# EAGLE design rgbw2 (EAGLE 6.6.0)
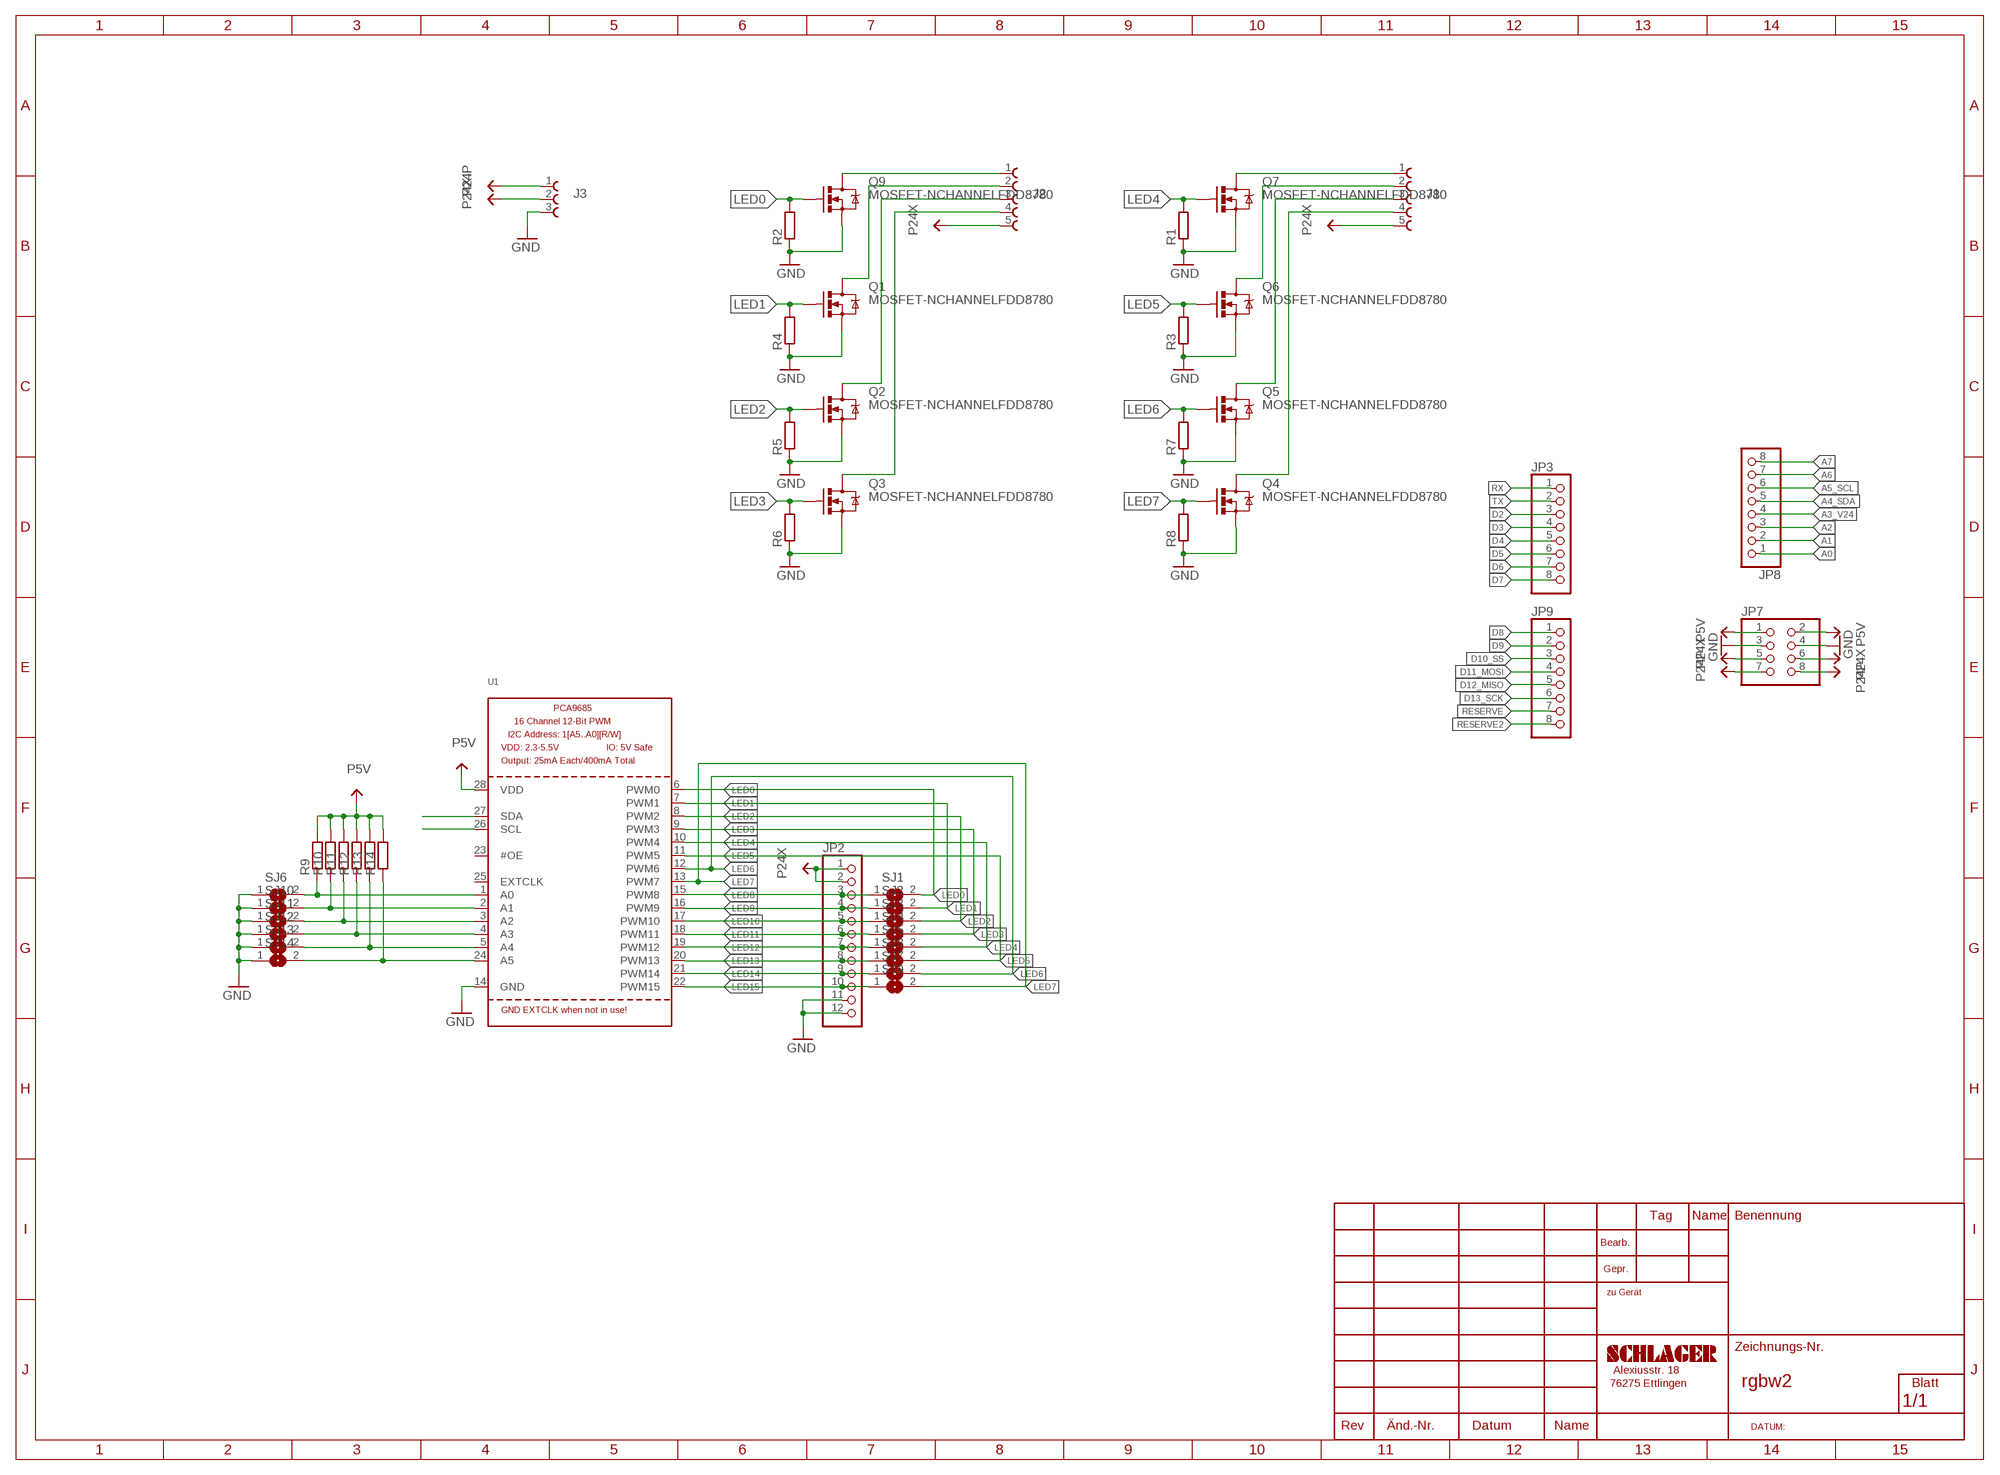
[diagram p0: schematic, sheet 1]

## Parts
J1  691322310005  [691322310005]
J2  691322310005  [691322310005]
J3  691313510003  [691313510003]
JP2  PINHD-1X12  [1X12]
JP3  PINHD-1X8  [1X08]
JP7  PINHD-2X4  [2X04]
JP8  PINHD-1X8  [1X08]
JP9  PINHD-1X8  [1X08]
Q1  MOSFET-NCHANNELFDD8780  [DPAK]
Q2  MOSFET-NCHANNELFDD8780  [DPAK]
Q3  MOSFET-NCHANNELFDD8780  [DPAK]
Q4  MOSFET-NCHANNELFDD8780  [DPAK]
Q5  MOSFET-NCHANNELFDD8780  [DPAK]
Q6  MOSFET-NCHANNELFDD8780  [DPAK]
Q7  MOSFET-NCHANNELFDD8780  [DPAK]
Q9  MOSFET-NCHANNELFDD8780  [DPAK]
R1  R-EU_R0805  [R0805]
R2  R-EU_R0805  [R0805]
R3  R-EU_R0805  [R0805]
R4  R-EU_R0805  [R0805]
R5  R-EU_R0805  [R0805]
R6  R-EU_R0805  [R0805]
R7  R-EU_R0805  [R0805]
R8  R-EU_R0805  [R0805]
R9  R-EU_R0805  [R0805]
R10  R-EU_R0805  [R0805]
R11  R-EU_R0805  [R0805]
R12  R-EU_R0805  [R0805]
R13  R-EU_R0805  [R0805]
R14  R-EU_R0805  [R0805]
SJ1  SJN  [SJ]
SJ2  SJN  [SJ]
SJ3  SJN  [SJ]
SJ4  SJN  [SJ]
SJ5  SJN  [SJ]
SJ6  SJN  [SJ]
SJ7  SJN  [SJ]
SJ8  SJN  [SJ]
SJ9  SJN  [SJ]
SJ10  SJN  [SJ]
SJ11  SJN  [SJ]
SJ12  SJN  [SJ]
SJ13  SJN  [SJ]
SJ14  SJN  [SJ]
U1  PCA9685  [TSSOP28]

## Nets
A0: JP8.1
A1: JP8.2
A2: JP8.3
A3_V24: JP8.4
A4_SDA: JP8.5 U1.27(SDA)
A5_SCL: JP8.6 U1.26(SCL)
A6: JP8.7
A7: JP8.8
D2: JP3.3
D3: JP3.4
D4: JP3.5
D5: JP3.6
D6: JP3.7
D7: JP3.8
D8: JP9.1
D9: JP9.2
D10_SS: JP9.3
D11_MOSI: JP9.4
D12_MISO: JP9.5
D13_SCK: JP9.6
GND: J3.3 JP2.11 JP2.12 JP7.3 JP7.4 Q1.3(S) Q2.3(S) Q3.3(S) Q4.3(S) Q5.3(S) Q6.3(S) Q7.3(S) Q9.3(S) R1.1 R2.1 R3.1 R4.1 R5.1 R6.1 R7.1 R8.1 SJ6.1 SJ10.1 SJ11.1 SJ12.1 SJ13.1 SJ14.1 U1.14(GND)
LED0: Q9.1(G) R2.2 SJ1.2 U1.6(PWM0)
LED1: Q1.1(G) R4.2 SJ2.2 U1.7(PWM1)
LED2: Q2.1(G) R5.2 SJ3.2 U1.8(PWM2)
LED3: Q3.1(G) R6.2 SJ4.2 U1.9(PWM3)
LED4: Q7.1(G) R1.2 SJ5.2 U1.10(PWM4)
LED5: Q6.1(G) R3.2 SJ8.2 U1.11(PWM5)
LED6: Q5.1(G) R7.2 SJ7.2 U1.12(PWM6)
LED7: Q4.1(G) R8.2 SJ9.2 U1.13(PWM7)
LED8: JP2.3 SJ1.1 U1.15(PWM8)
LED9: JP2.4 SJ2.1 U1.16(PWM9)
LED10: JP2.5 SJ3.1 U1.17(PWM10)
LED11: JP2.6 SJ4.1 U1.18(PWM11)
LED12: JP2.7 SJ5.1 U1.19(PWM12)
LED13: JP2.8 SJ8.1 U1.20(PWM13)
LED14: JP2.9 SJ7.1 U1.21(PWM14)
LED15: JP2.10 SJ9.1 U1.22(PWM15)
N$1: R9.1 SJ6.2 U1.1(A0)
N$2: J2.1 Q9.4(D)
N$3: J2.2 Q1.4(D)
N$4: J1.3 Q5.4(D)
N$5: J2.3 Q2.4(D)
N$6: J2.4 Q3.4(D)
N$7: J1.4 Q4.4(D)
N$8: J1.1 Q7.4(D)
N$9: J1.2 Q6.4(D)
N$10: R10.1 SJ10.2 U1.2(A1)
N$11: R11.1 SJ11.2 U1.3(A2)
N$12: R12.1 SJ12.2 U1.4(A3)
N$13: R13.1 SJ13.2 U1.5(A4)
N$14: R14.1 SJ14.2 U1.24(A5)
P5V: JP7.1 JP7.2 R9.2 R10.2 R11.2 R12.2 R13.2 R14.2 U1.28(VDD)
P24P: J3.1 JP7.7 JP7.8
P24X: J1.5 J2.5 J3.2 JP2.1 JP2.2 JP7.5 JP7.6
RESERVE: JP9.7
RESERVE2: JP9.8
RX: JP3.1
TX: JP3.2
Unconnected: U1.23(#OE) U1.25(EXTCLK)

## Library data of the parts
J1 J2 = Eagle_TERMINAL_BLOCKS_rev16a:691322310005: WR-TBL Serie 322 - 3.81mm Vertical PCB Header , 5 Pins=>Code : Con_TBL_Pluggable_3.81_PCB_THT_Simple_691322310005 <http://katalog.we-online.de/media/images/eican/Con_TBL_Pluggable_3.81_PCB_THT_Simple_6913223100xx_pf2.jpg> Details see: http://katalog.we-online.de/en/em/691_322_310_0xx Created 2014-06-19, Karrer Zheng 2014 (C) Würth Elektronik
J3 = Eagle_TERMINAL_BLOCKS_rev16a:691313510003: WR-TBL Serie 313 - 5.08 mm Close Horizontal PCB Header , 3 Pins=>Code : Con_TBL_Pluggable_5.08_PCB_THT_Simple_H_691313510003 <http://katalog.we-online.de/media/images/eican/Con_TBL_Pluggable_5.08_PCB_THT_Simple_H_6913135100xx_pf2.jpg> Details see: http://katalog.we-online.de/en/em/691_313_510_0xx Created 2014-06-25, Karrer Zheng 2014 (C) Würth Elektronik
JP2 = pinhead:PINHD-1X12: PIN HEADER
JP3 JP8 JP9 = pinhead:PINHD-1X8: PIN HEADER
JP7 = pinhead:PINHD-2X4: PIN HEADER
Q1-Q7 Q9 = SparkFun-DiscreteSemi:MOSFET-NCHANNEL: Common NMOSFET Parts MFG P/N Store ID Prod ID FDD8780 TRANS-09984 SI7820DN TRANS-11055 FDS6630A IC-08089 2N7002PW TRANS-11151 FQP30N06L COM-10213 TRANS-10060 BSS123LT1G TRANS-08345 BSS138 TRANS-00830 BS170 2N7000; PROD_ID: TRANS-09984
R1-R14 = schlager_passiv:R-EU_: RESISTOR, European symbol
SJ1-SJ14 = jumper:SJ: SMD solder JUMPER
U1 = adafruit:PCA9685: PCA9685 - 16 Channel 12-Bit I2C PWM Controller 5.0V tolerant 16 channel, 12-bit I2C PWM controller with 25mA per output (max. 400mA total) Digikey: 568-5931-1-ND

## Net classes
4 USBpair: width 0.254 mm, drill 0.406 mm, clearance 0.508 mm

## Board
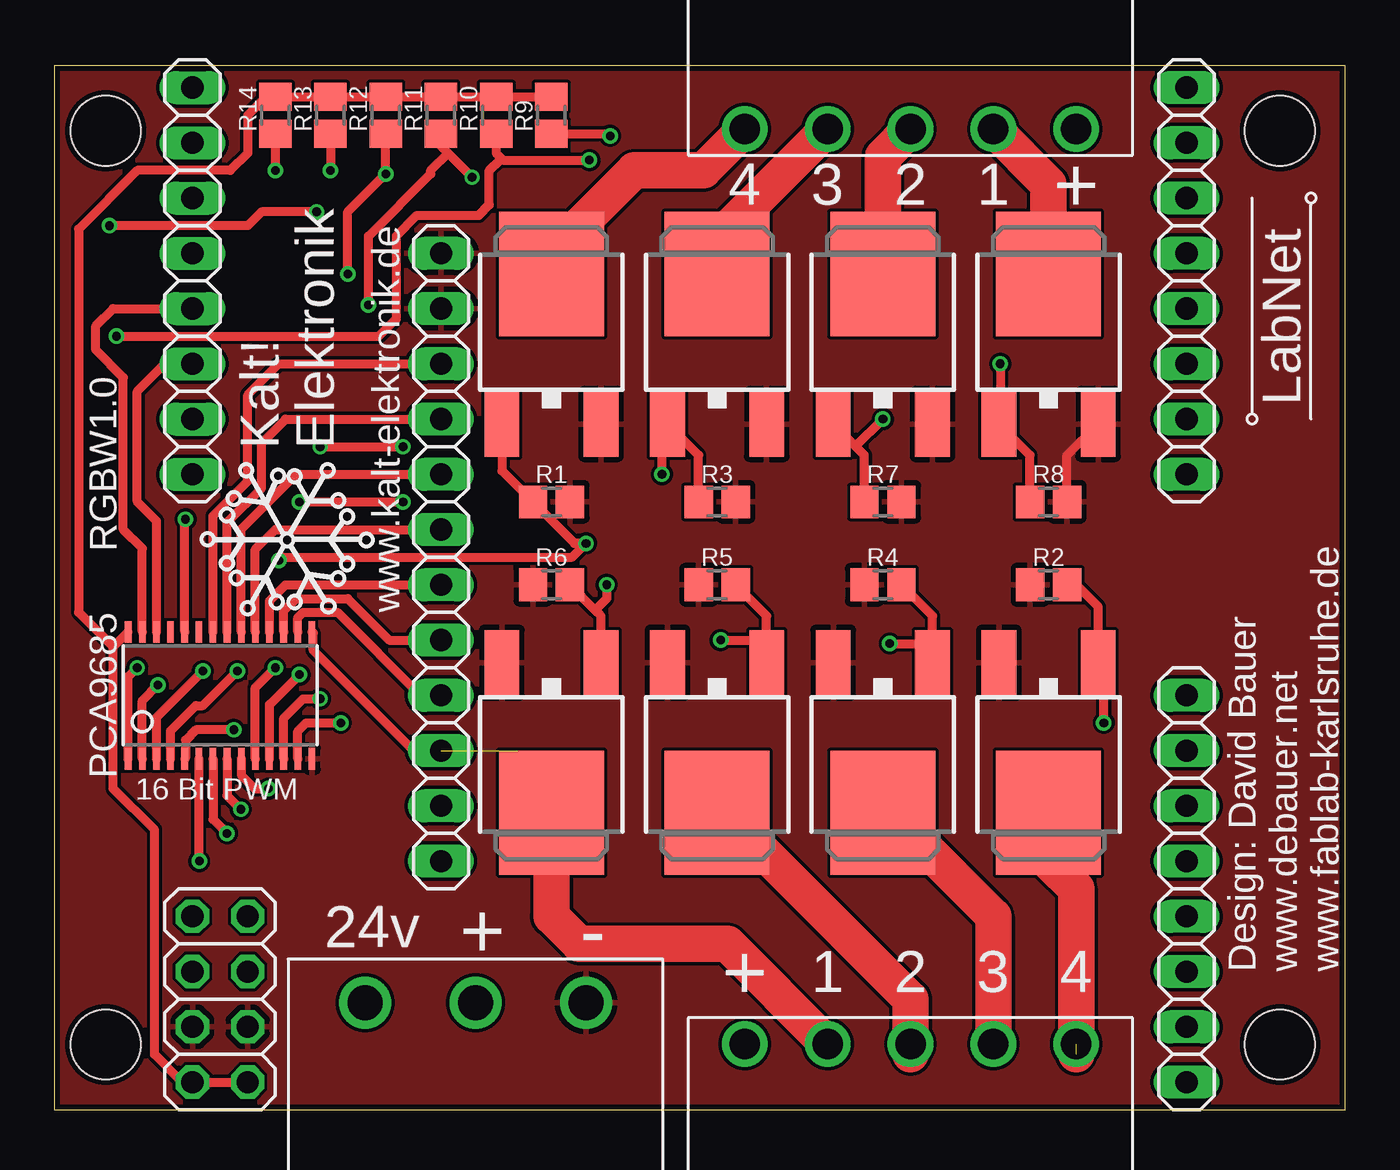
[diagram p1: board, top side]
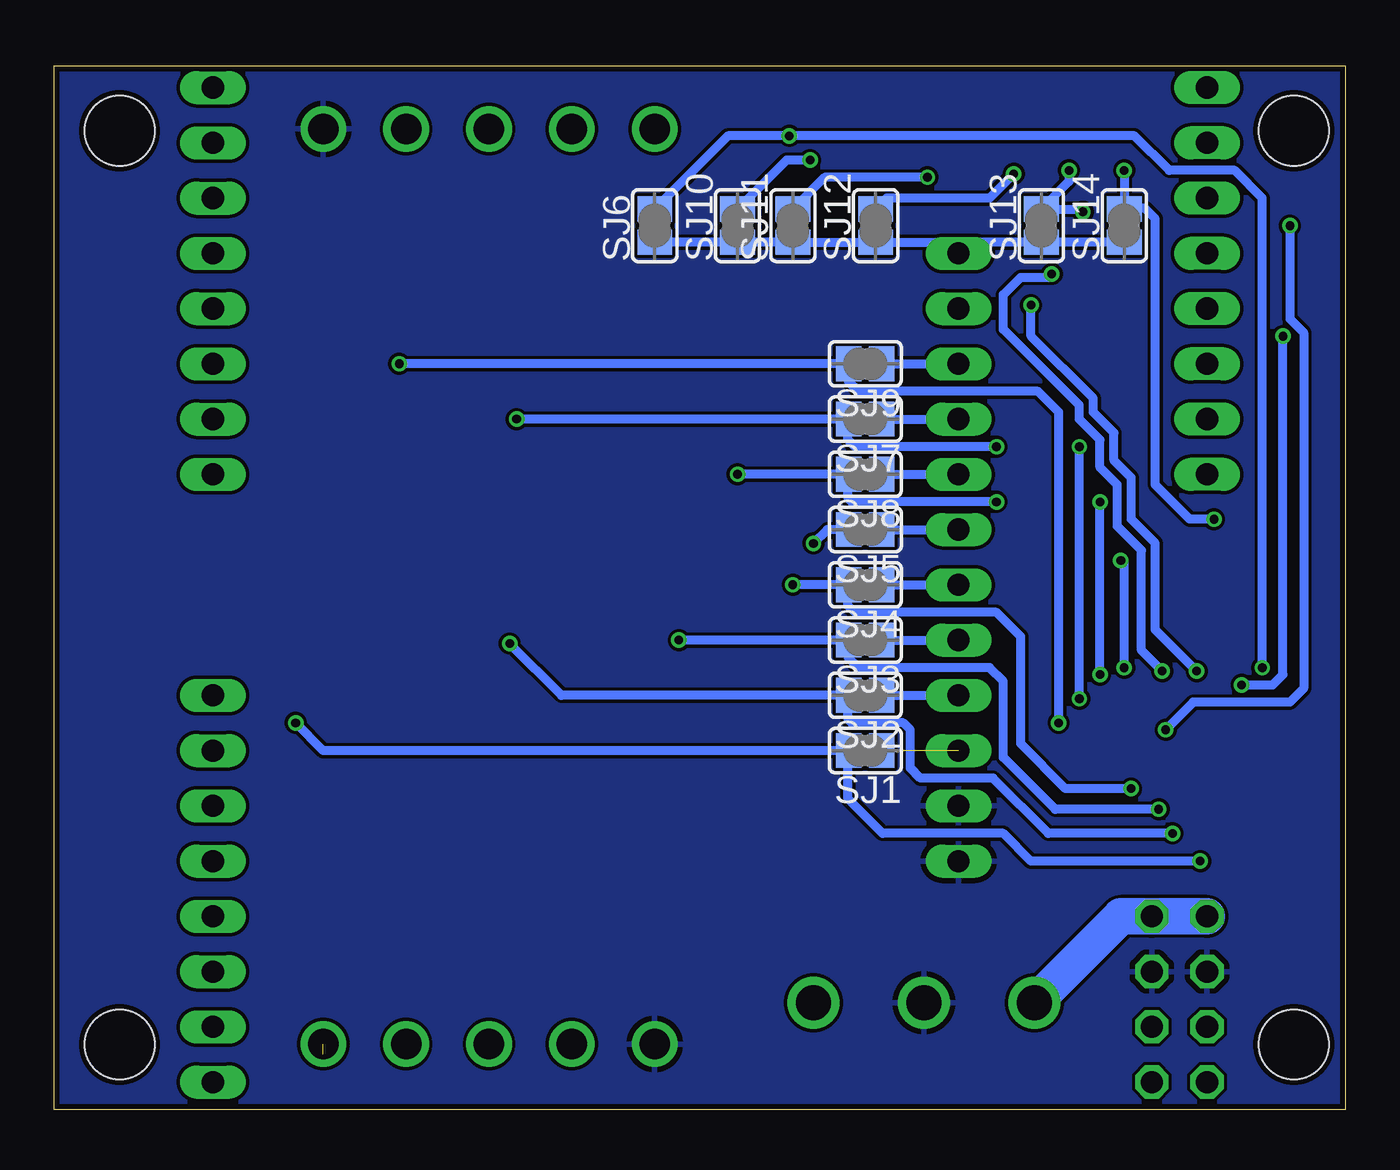
[diagram p2: board, bottom side, seen from below]

Size 59.36 x 48 mm. Coordinates in mm from the lower left corner, seen from the top.
Outline: 0,0 59.36,0 59.36,48 0,48 0,0
Copper layers (1*16): Top 0.035mm / dielectric 1.5mm / Bottom 0.035mm
Design rules "ITEADstudio_DRC": minimum track width 6mil, minimum drill 12mil, track to track 6mil, track to pad 6mil, pad to pad 6mil, via to via 6mil, smd to smd 0mil, copper to edge 10mil, drill to drill 10mil, minimum pad ring 10mil, minimum via ring 6mil, stop-mask expansion 2mil, vias tented up to drill 100mil, thermal gap 10mil
Holes 3.2 mm at 56.36,45 56.36,3 2.36,3 2.36,45

### Footprints (pad centres in the part's own frame; a part is rotated, then mirrored left to right if it is on the bottom)
691322310005 = drill 1.4: 1 -3.81,0; 2 0,0; 3 3.81,0; 4 7.62,0; 5 11.43,0
691313510003 = drill 1.6: 1 -5.08,0; 2 0,0; 3 5.08,0
1X12 = drill 1.016 long: 1 -13.97,0; 2 -11.43,0; 3 -8.89,0; 4 -6.35,0; 5 -3.81,0; 6 -1.27,0; 7 1.27,0; 8 3.81,0; 9 6.35,0; 10 8.89,0; 11 11.43,0; 12 13.97,0
1X08 = drill 1.016 long: 1 -8.89,0; 2 -6.35,0; 3 -3.81,0; 4 -1.27,0; 5 1.27,0; 6 3.81,0; 7 6.35,0; 8 8.89,0
2X04 = drill 1.016 octagon: 1 -3.81,-1.27; 2 -3.81,1.27; 3 -1.27,-1.27; 4 -1.27,1.27; 5 1.27,-1.27; 6 1.27,1.27; 7 3.81,-1.27; 8 3.81,1.27
DPAK = smd 1.6 x 3: 1 -2.28,-5.31; 3 2.28,-5.31 | smd 4.826 x 5.715: 4 0,1.588
R0805 = smd 1.3 x 1.5: 1 -0.85,0; 2 0.85,0
SJ = smd 1.168 x 1.6: 1 -0.762,0; 2 0.762,0
TSSOP28 = smd 0.305 x 0.991: 1 -4.225,-2.918; 2 -3.575,-2.918; 3 -2.925,-2.918; 4 -2.275,-2.918; 5 -1.625,-2.918; 6 -0.975,-2.918; 7 -0.325,-2.918; 8 0.325,-2.918; 9 0.975,-2.918; 10 1.625,-2.918; 11 2.275,-2.918; 12 2.925,-2.918; 13 3.575,-2.918; 14 4.225,-2.918; 15 4.225,2.918; 16 3.575,2.918; 17 2.925,2.918; 18 2.275,2.918; 19 1.625,2.918; 20 0.975,2.918; 21 0.325,2.918; 22 -0.325,2.918; 23 -0.975,2.918; 24 -1.625,2.918; 25 -2.275,2.918; 26 -2.925,2.918; 27 -3.575,2.918; 28 -4.225,2.918

### Placement (x,y rotation side)
J1  35.56,45.09 0 top
J2  43.18,3.02 180 top
J3  19.37,4.92 0 top
JP2  17.78,25.4 90 top
JP3  52.07,10.16 90 top
JP7  7.62,5.08 90 top
JP8  6.35,38.1 270 top
JP9  52.07,38.1 90 top
Q1  38.1,15.24 180 top
Q2  30.48,15.24 180 top
Q3  22.86,15.24 180 top
Q4  45.72,36.83 0 top
Q5  38.1,36.83 0 top
Q6  30.48,36.83 0 top
Q7  22.86,36.83 0 top
Q9  45.72,15.24 180 top
R1  22.86,27.94 180 top
R2  45.72,24.13 0 top
R3  30.48,27.94 180 top
R4  38.1,24.13 0 top
R5  30.48,24.13 0 top
R6  22.86,24.13 0 top
R7  38.1,27.94 180 top
R8  45.72,27.94 180 top
R9  22.86,45.72 90 top
R10  20.32,45.72 90 top
R11  17.78,45.72 90 top
R12  15.24,45.72 90 top
R13  12.7,45.72 90 top
R14  10.16,45.72 90 top
SJ1  22.07,16.51 180 bottom
SJ2  22.07,19.05 180 bottom
SJ3  22.07,21.59 180 bottom
SJ4  22.07,24.13 180 bottom
SJ5  22.07,26.67 180 bottom
SJ6  31.75,40.64 90 bottom
SJ7  22.07,31.75 180 bottom
SJ8  22.07,29.21 180 bottom
SJ9  22.07,34.29 180 bottom
SJ10  27.94,40.64 90 bottom
SJ11  25.4,40.64 90 bottom
SJ12  21.59,40.64 90 bottom
SJ13  13.97,40.64 90 bottom
SJ14  10.16,40.64 90 bottom
U1  7.62,19.05 0 top
U$1  [KALT!ELEKTRONIK]  10.8,33.5 90 top
U$2  [LABNET]  57.15,36.83 90 top

### Tracks (layer width: path | path; a pad name or v marks a point on that pad's centre or on a via)
A4_SDA
  Top 0.406: U1.27 4.05,25.8 3.17,26.67 3.17,33.66 1.91,34.92 1.91,36.04 2.7,36.83 JP8.5 5.4,36.83
A5_SCL
  Top 0.406: U1.26 4.7,27.05 3.81,27.94 3.81,33.02 5.08,34.29 JP8.6
GND
  Top 0.406: R8.1 46.57,30.09 Q4.3
  Bottom 0.406: SJ14.1 SJ13.1 17.27,39.88 JP2.12 18.29,39.88 SJ12.1 SJ11.1 SJ10.1 SJ6.1
  pour Top: -67.31,71.12 62.23,71.12 62.23,-13.97 -67.31,-13.97
LED0  (via drill 0.4)
  Top 0.406: v48.26,17.78 48.26,20.29 Q9.1 48,23.12 46.99,24.13 R2.2 | U1.6 6.64,11.45 v6.67,11.43
  Bottom 0.406: v48.26,17.78 46.99,16.51 SJ1.2 22.86,16.48 22.86,14.29 21.27,12.7 15.72,12.7 14.45,11.43 v6.67,11.43
LED1  (via drill 0.4)
  Top 0.406: Q1.1 40.38,21.43 | 40.38,21.43 40.38,22.7 R4.2 | v38.42,21.43 40.38,21.43 | U1.7 7.3,13.34 v7.94,12.7
  Bottom 0.406: v38.42,21.43 36.04,19.05 SJ2.2 22.86,19.02 22.86,17.94 22.7,17.78 20.32,17.78 20,17.46 20,15.72 19.53,15.24 16.19,15.24 13.65,12.7 v7.94,12.7
LED2  (via drill 0.4)
  Top 0.406: Q2.1 32.76,21.43 | 32.76,21.43 32.76,22.7 R5.2 | v30.64,21.59 32.6,21.59 32.76,21.43 | U1.8 7.95,14.44 v8.57,13.81
  Bottom 0.406: v30.64,21.59 SJ3.2 22.86,21.56 22.86,20.8 22.38,20.32 16.35,20.32 15.72,19.68 15.72,16.19 13.34,13.81 v8.57,13.81
LED3  (via drill 0.4)
  Top 0.406: Q3.1 25.14,22.7 24.87,22.97 | 24.87,22.97 R6.2 | v25.4,24.13 25.4,23.5 24.87,22.97 | U1.9 8.59,15.38 9.21,14.76 v9.84,14.76
  Bottom 0.406: v25.4,24.13 SJ4.2 22.86,24.1 22.86,23.18 22.54,22.86 16.03,22.86 14.92,21.75 14.92,16.83 12.86,14.76 v9.84,14.76
LED4  (via drill 0.4)
  Top 0.406: Q7.1 20.58,29.37 R1.2 23.92,26.04 v24.45,26.04 23.81,25.4 10.48,25.4 v10.32,25.24 | U1.10 9.24,19.41 v10.16,20.32
  Bottom 0.406: SJ5.2 23.81,26.67 v24.45,26.04 | v10.16,20.32 10.16,25.08 v10.32,25.24
LED5  (via drill 0.4)
  Top 0.406: R3.2 29.63,30.09 28.59,31.13 | 28.59,31.13 Q6.1 | v27.94,29.21 27.94,30.48 28.59,31.13 | U1.11 9.89,18.63 v11.27,20 | v11.27,27.94 v16.03,27.94
  Bottom 0.406: v27.94,29.21 SJ8.2 22.86,29.18 22.86,28.1 22.7,27.94 v16.03,27.94 | v11.27,20 v11.27,27.94
LED6  (via drill 0.4)
  Top 0.406: 36.84,30.5 37.25,30.09 R7.2 | 36.84,30.5 Q5.1 | v38.1,31.75 36.84,30.5 | U1.12 10.55,18.01 11.43,18.89 v12.22,18.89 | v12.22,30.48 v16.03,30.48
  Bottom 0.406: v38.1,31.75 SJ7.2 22.86,31.72 22.86,30.8 22.54,30.48 v16.03,30.48 | v12.22,18.89 v12.22,30.48
LED7  (via drill 0.4)
  Top 0.406: R8.2 44.87,30.09 Q4.1 43.5,31.58 v43.5,34.29 | U1.13 11.2,17.39 11.59,17.78 v13.18,17.78
  Bottom 0.406: v43.5,34.29 SJ9.2 22.86,34.26 22.86,33.5 22.38,33.02 14.13,33.02 13.18,32.07 v13.18,17.78
LED8  (1 unrouted)
  Top 0.406: JP2.3 16.51,16.51 11.91,21.11 11.91,21.91 U1.15
LED9
  Top 0.406: U1.16 11.2,22.62 11.43,22.86 13.02,22.86 16.83,19.05 JP2.4 18.26,19.05
  Bottom 0.406: SJ2.1 JP2.4
LED10
  Top 0.406: U1.17 10.55,22.93 11.11,23.5 13.49,23.5 15.4,21.59 JP2.5
  Bottom 0.406: SJ3.1 JP2.5
LED11
  Top 0.406: U1.18 9.89,23.39 10.64,24.13 JP2.6
  Bottom 0.406: SJ4.1 JP2.6
LED12
  Top 0.406: U1.19 9.24,25.75 10.16,26.67 JP2.7
  Bottom 0.406: SJ5.1 JP2.7
LED13
  Top 0.406: U1.20 8.59,26.69 11.11,29.21 JP2.8
  Bottom 0.406: SJ8.1 JP2.8
LED14
  Top 0.406: U1.21 7.95,27 9.52,28.57 9.52,30.64 10.64,31.75 JP2.9
  Bottom 0.406: SJ7.1 JP2.9
LED15
  Top 0.406: U1.22 7.3,27.3 8.89,28.89 8.89,32.86 10.32,34.29 JP2.10
  Bottom 0.406: SJ9.1 JP2.10
N$1  (via drill 0.4)
  Top 0.406: R9.1 25.46,44.87 v25.56,44.77 | U1.1 3.39,19.91 v3.81,20.32
  Bottom 0.406: SJ6.2 28.39,44.77 v25.56,44.77 9.68,44.77 8.1,43.18 5.08,43.18 3.81,41.91 v3.81,20.32
N$2  (1 unrouted)
  Top 1.676: Q9.4 45.72,11.43 46.99,10.16 46.99,2.54
N$3
  Top 1.676: Q1.4 38.42,13.65 43.18,8.89 J2.2
N$4
  Top 1.676: Q5.4 38.1,43.81 J1.3
N$5
  Top 1.676: Q2.4 30.8,13.65 39.37,5.08 J2.3 39.37,2.54
N$6
  Top 1.676: Q3.4 22.86,8.89 24.13,7.62 30.96,7.62 J2.4
N$7
  Top 1.676: Q4.4 45.72,42.55 J1.4
N$8
  Top 1.676: Q7.4 22.86,39.37 26.67,43.18 29.84,43.18 J1.1
N$9
  Top 1.676: Q6.4 30.48,40.01 J1.2
N$10  (via drill 0.4)
  Top 0.406: R10.1 20.32,43.97 20.64,43.66 | 20.64,43.66 v24.61,43.66 | 20.64,43.66 20.48,43.66 20,43.18 20,41.59 19.53,41.12 16.67,41.12 15.72,40.16 15.72,36.35 14.92,35.56 v2.86,35.56 | U1.2 4.05,18.81 v4.76,19.53
  Bottom 0.406: v24.61,43.66 25.69,43.66 SJ10.2 | v4.76,19.53 3.33,19.53 2.86,20 v2.86,35.56
N$11  (via drill 0.4)
  Top 0.406: U1.3 4.7,18.03 v6.83,20.16 | R11.1 17.78,44.29 18.1,43.97 | 18.1,43.97 v19.21,42.86 | v14.45,36.99 14.45,40.16 17.3,43.02 17.3,43.18 18.1,43.97
  Bottom 0.406: v19.21,42.86 23.94,42.86 SJ11.2 | v6.83,20.16 8.73,22.07 8.73,26.04 9.84,27.15 9.84,29.05 10.64,29.84 10.64,31.11 11.59,32.07 11.59,32.7 14.45,35.56 v14.45,36.99
N$12  (via drill 0.4)
  Top 0.406: U1.4 5.34,17.41 6.51,18.57 6.83,18.57 v8.41,20.16 | 15.77,44.87 R12.1 v15.24,43.02 13.49,41.27 v13.49,38.42
  Bottom 0.406: SJ12.2 21.08,41.91 16.35,41.91 v15.24,43.02 | v8.41,20.16 9.37,21.11 9.37,25.72 10.48,26.83 10.48,28.73 11.27,29.53 11.27,30.8 12.22,31.75 12.22,32.38 15.72,35.88 15.72,37.47 14.92,38.26 13.65,38.26 v13.49,38.42
N$13  (via drill 0.4)
  Top 0.406: R13.1 v12.7,43.18 | v12.06,41.27 9.52,41.27 8.89,40.64 v2.54,40.64 | v8.26,17.46 6.51,17.46 6.03,16.99 6.03,16.17 U1.5
  Bottom 0.406: v12.7,43.18 12.7,42.67 SJ13.2 12.19,41.4 v12.06,41.27 | v2.54,40.64 2.54,36.35 1.91,35.72 1.91,19.37 2.54,18.73 6.98,18.73 v8.26,17.46
N$14  (via drill 0.4)
  Top 0.406: R14.1 v10.16,43.18 | U1.24 5.99,27.11 v6.03,27.15
  Bottom 0.406: v10.16,43.18 SJ14.2 10.13,41.43 9.21,41.43 8.73,40.96 8.73,28.73 7.14,27.15 v6.03,27.15
P5V
  Top 0.406: JP7.1 JP7.2 5.87,1.27 4.6,2.54 4.6,12.86 2.7,14.76 2.7,21.27 | 2.7,21.27 U1.28 | R9.2 R10.2 R11.2 R12.2 R13.2 R14.2 9.74,46.57 8.89,45.72 8.89,43.97 8.1,43.18 3.81,43.18 1.11,40.48 1.11,22.86 2.7,21.27
P24P
  Bottom 1.676: JP7.8 JP7.7 10.32,8.89 J3.1
P24X
  pour Bottom (rank 5): -55.09,71.12 67.31,71.12 67.31,-12.7 -54.13,-12.54

### Text on the board
tPlace: 4 | 3 | 2 | 1 | + | RGBW1.0 | www.kalt-elektronik.de | PCA9685 | 16 Bit PWM | 24v | + | - | + | 1 | 2 | 3 | 4 | Design: David Bauer | www.debauer.net | www.fablab-karlsruhe.de